# Altium schematic sheet ESP8266.SchDoc
size A4
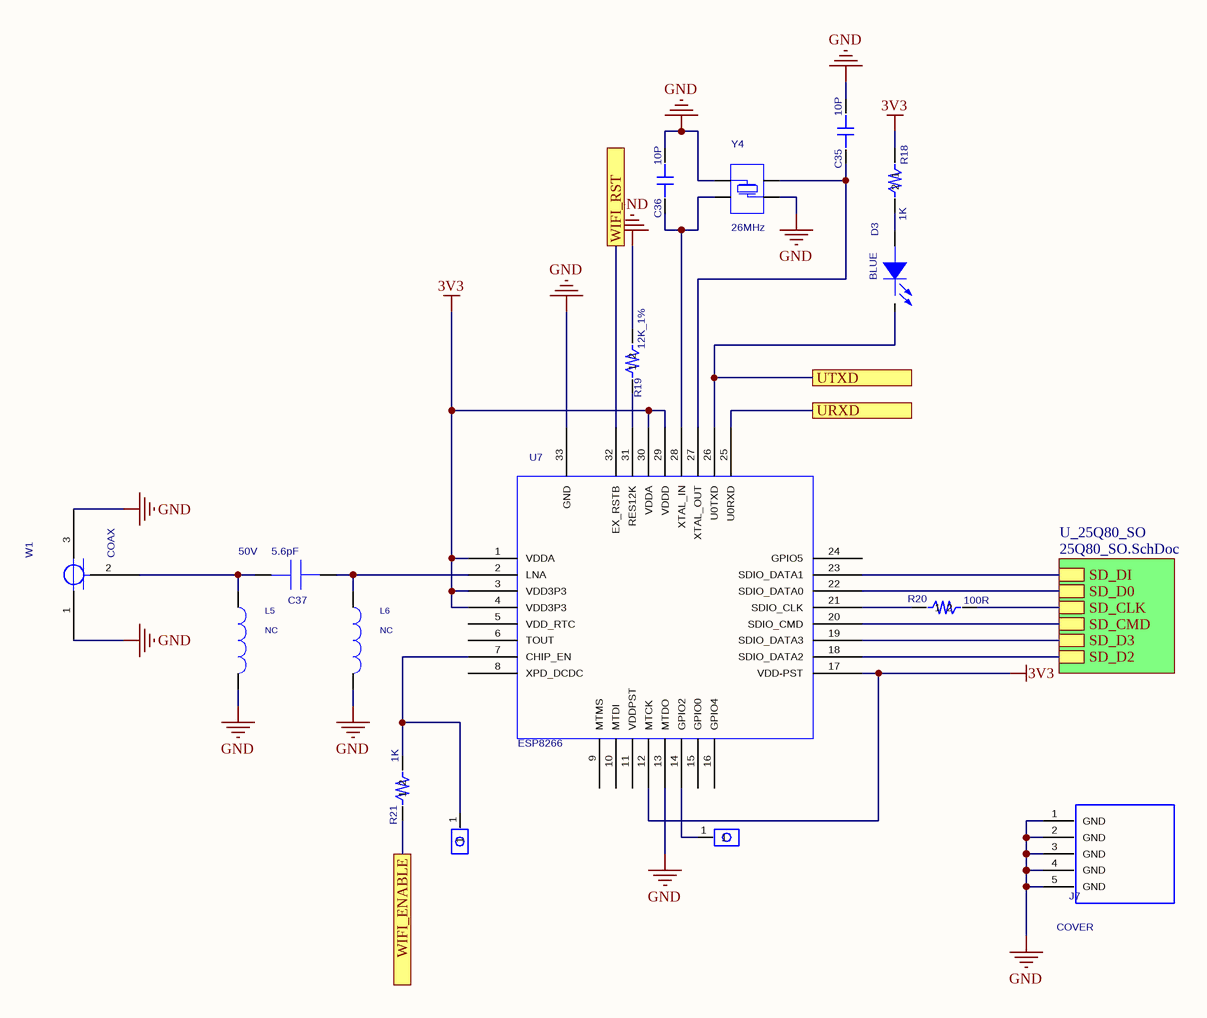
[diagram p0: ESP8266.SchDoc]

## Parts
C35  value 10P  [RES_0603_FIRE]  (hidden comment: CAP_10P_0603_FIRE)
C36  value 10P  [RES_0603_FIRE]  (hidden comment: CAP_10P_0603_FIRE)
C37  value 5.6pF  Voltage: 50V  [0603]  (hidden comment: CAP_NP)
D3  value BLUE  [LED_BLUE_0603_FIRE]  (hidden comment: LED_BLUE_0603_FIRE)
J5  1_DIP  [1_DIP]  (value not drawn)
J6  1_DIP  [1_DIP]  (value not drawn)
J7  COVER  [COVER1]
L5  value NC  [0603]  (hidden comment: IND)
L6  value NC  [0603]  (hidden comment: IND)
R18  value 1K  [RES_0603_FIRE]  (hidden comment: RES_1K_0603_FIRE)
R19  value 12K_1%  [RES_0603_FIRE]  (hidden comment: RES_12K_1%_0603_FIRE)
R20  value 100R  [RES_0603_FIRE]  (hidden comment: RES_100R_0603_FIRE)
R21  value 1K  [RES_0603_FIRE]  (hidden comment: RES_1K_0603_FIRE)
U7  ESP8266  [QFN32_1]
W1  COAX  [UFL-3]
Y4  value 26MHz  [NX3225SA]  (hidden comment: CRYSTAL5032)

## Sub-sheets
U_25Q80_SO = 25Q80_SO.SchDoc: SD_CMD, SD_D0, SD_D3, SD_D2, SD_CLK, SD_DI

## Ports
URXD, UTXD, WIFI_ENABLE, WIFI_RST

## Nets
3V3: R18.1 U7.1(VDDA) U7.3(VDD3P3) U7.4(VDD3P3) U7.12(MTCK) U7.17(VDD-PST) U7.29(VDDD) U7.30(VDDA)
GND: C35.2 C36.2 J7.1(GND) J7.2(GND) J7.3(GND) J7.4(GND) J7.5(GND) L5.2 L6.2 R19.2 U7.13(MTDO) U7.33(GND) W1.1(CENTER_1) W1.3(CENTER_2) Y4.1 Y4.3
URXD: U7.25(U0RXD) ; port URXD
UTXD: D3.K(CATHODE) U7.26(U0TXD) ; port UTXD
WIFI_ENABLE: R21.1 ; port WIFI_ENABLE
WIFI_RST: U7.32(EX_RSTB) ; port WIFI_RST
NetC35_1: C35.1 U7.27(XTAL_OUT) Y4.4
NetC36_1: C36.1 U7.28(XTAL_IN) Y4.2
NetC37_1: C37.1 L6.1 U7.2(LNA)
NetC37_2: C37.2 L5.1 W1.2(SHIELD)
NetD3_A: D3.A(ANODE) R18.2
NetJ5_1: J5.1 U7.14(GPIO2)
NetJ6_1: J6.1 R21.2 U7.7(CHIP_EN)
NetR19_1: R19.1 U7.31(RES12K)
NetR20_1: R20.1 U7.21(SDIO_CLK)
NetR20_2: R20.2 ; sheet U_25Q80_SO/SD_CLK
NetU7_18: U7.18(SDIO_DATA2) ; sheet U_25Q80_SO/SD_D2
NetU7_19: U7.19(SDIO_DATA3) ; sheet U_25Q80_SO/SD_D3
NetU7_20: U7.20(SDIO_CMD) ; sheet U_25Q80_SO/SD_CMD
NetU7_22: U7.22(SDIO_DATA0) ; sheet U_25Q80_SO/SD_D0
NetU7_23: U7.23(SDIO_DATA1) ; sheet U_25Q80_SO/SD_DI

Not connected (* = marked no-connect by the designer): U7 5(VDD_RTC) 6(TOUT) 8(XPD_DCDC) 9(MTMS) 10(MTDI) 11(VDDPST) 15(GPIO0) 16(GPIO4) 24(GPIO5)

## Library data of the parts
C35 C36 = CAP_10P_0603_FIRE: 0603; Manufacture 1: SUPERCAP; Tolerance: +-5%; PCB DECAL: RES_0603_FIRE
C37 = CAP_NP: 0603, X7R, 50V, 10%(K); Partname: 贴片电容  0603; Mfr: Fenghua; Mfr_Part_Number: 0603B104K500NT; Part_Number: CA100039-01; Spec: 100nF/50V 10%(K) X7R,0603B104K500NT(风华); Remarks: Checked; Gtech_Number: 50306031003K50V01; Source_Path: D:\CADENCELIB\CAPTURELIB\LC_PASSIVE.OLB; PCB DECAL: 0603; Datasheet: D:\CadenceLib\Partbase\Datasheet\Capacitor\Fenghua\LC503_Fenghua-X7R.pdf; Tolerance: ±10%; Availability: 30
D3 = LED_BLUE_0603_FIRE: blue,0603; PCB DECAL: LED_BLUE_0603_FIRE
L5 L6 = IND: 1uH, 1.1R@245MHz, 245mA; Partname: 贴片电感; Mfr: TDK; Mfr_Part_Number: NLV25T-1R0J-PF; Part_Number: IN100085-01; Spec: 1uH,NLV25T-1R0J-PF(TDK); Tolerance: 5%; Resistance: 1.1R; Source_Path: D:\CADENCELIB\CAPTURELIB\LC_PASSIVE.OLB; PCB DECAL: 0603; Current: 245mA; Availability: 0
R18 R21 = RES_1K_0603_FIRE: 0402; Manufacture 1: SUPEROHM; Tolerance: +-5%; Assembly: SMD; PCB DECAL: RES_0603_FIRE
R19 = RES_12K_1%_0603_FIRE: 0402; Manufacture 1: SUPEROHM; Tolerance: +-1%; Assembly: SMD; PCB DECAL: RES_0603_FIRE
R20 = RES_100R_0603_FIRE: 0402; Manufacture 1: SUPEROHM; Tolerance: +-5%; Assembly: SMD; PCB DECAL: RES_0603_FIRE
U7 = ESP8266: Source_Path: C:\CADENCE\SPB_16.6\TOOLS\CAPTURE\LIBRARY\CAPSYM.OLB; PCB DECAL: QFN32_1; Value: ESP8266
W1 = COAX: Source_Path: C:\CADENCE\SPB_16.6\TOOLS\CAPTURE\LIBRARY\CONNECTOR.OLB; PCB DECAL: UFL-3; Value: COAX
Y4 = CRYSTAL5032: 27.12MHz,SMD5032,-30 to 85℃; Part_Number: OS200008-01; Mfr_Part_Number: E5SB27_1200F20G13; Mfr: Hosonic; Partname: 贴片晶振; Spec: 27.12MHz,E5SB27_1200F20G13(Hosonic); Source_Path: D:\CADENCELIB\CAPTURELIB\LC_DISCRETE.OLB; PCB DECAL: NX3225SA; Availability: 0
J5 J6 = 1_DIP: PCB DECAL: 1_DIP
J7 = COVER: PCB DECAL: COVER1